# EAGLE design CAN-BUS(FD) HAT for Raspberry Pi (EAGLE 9.5.2)
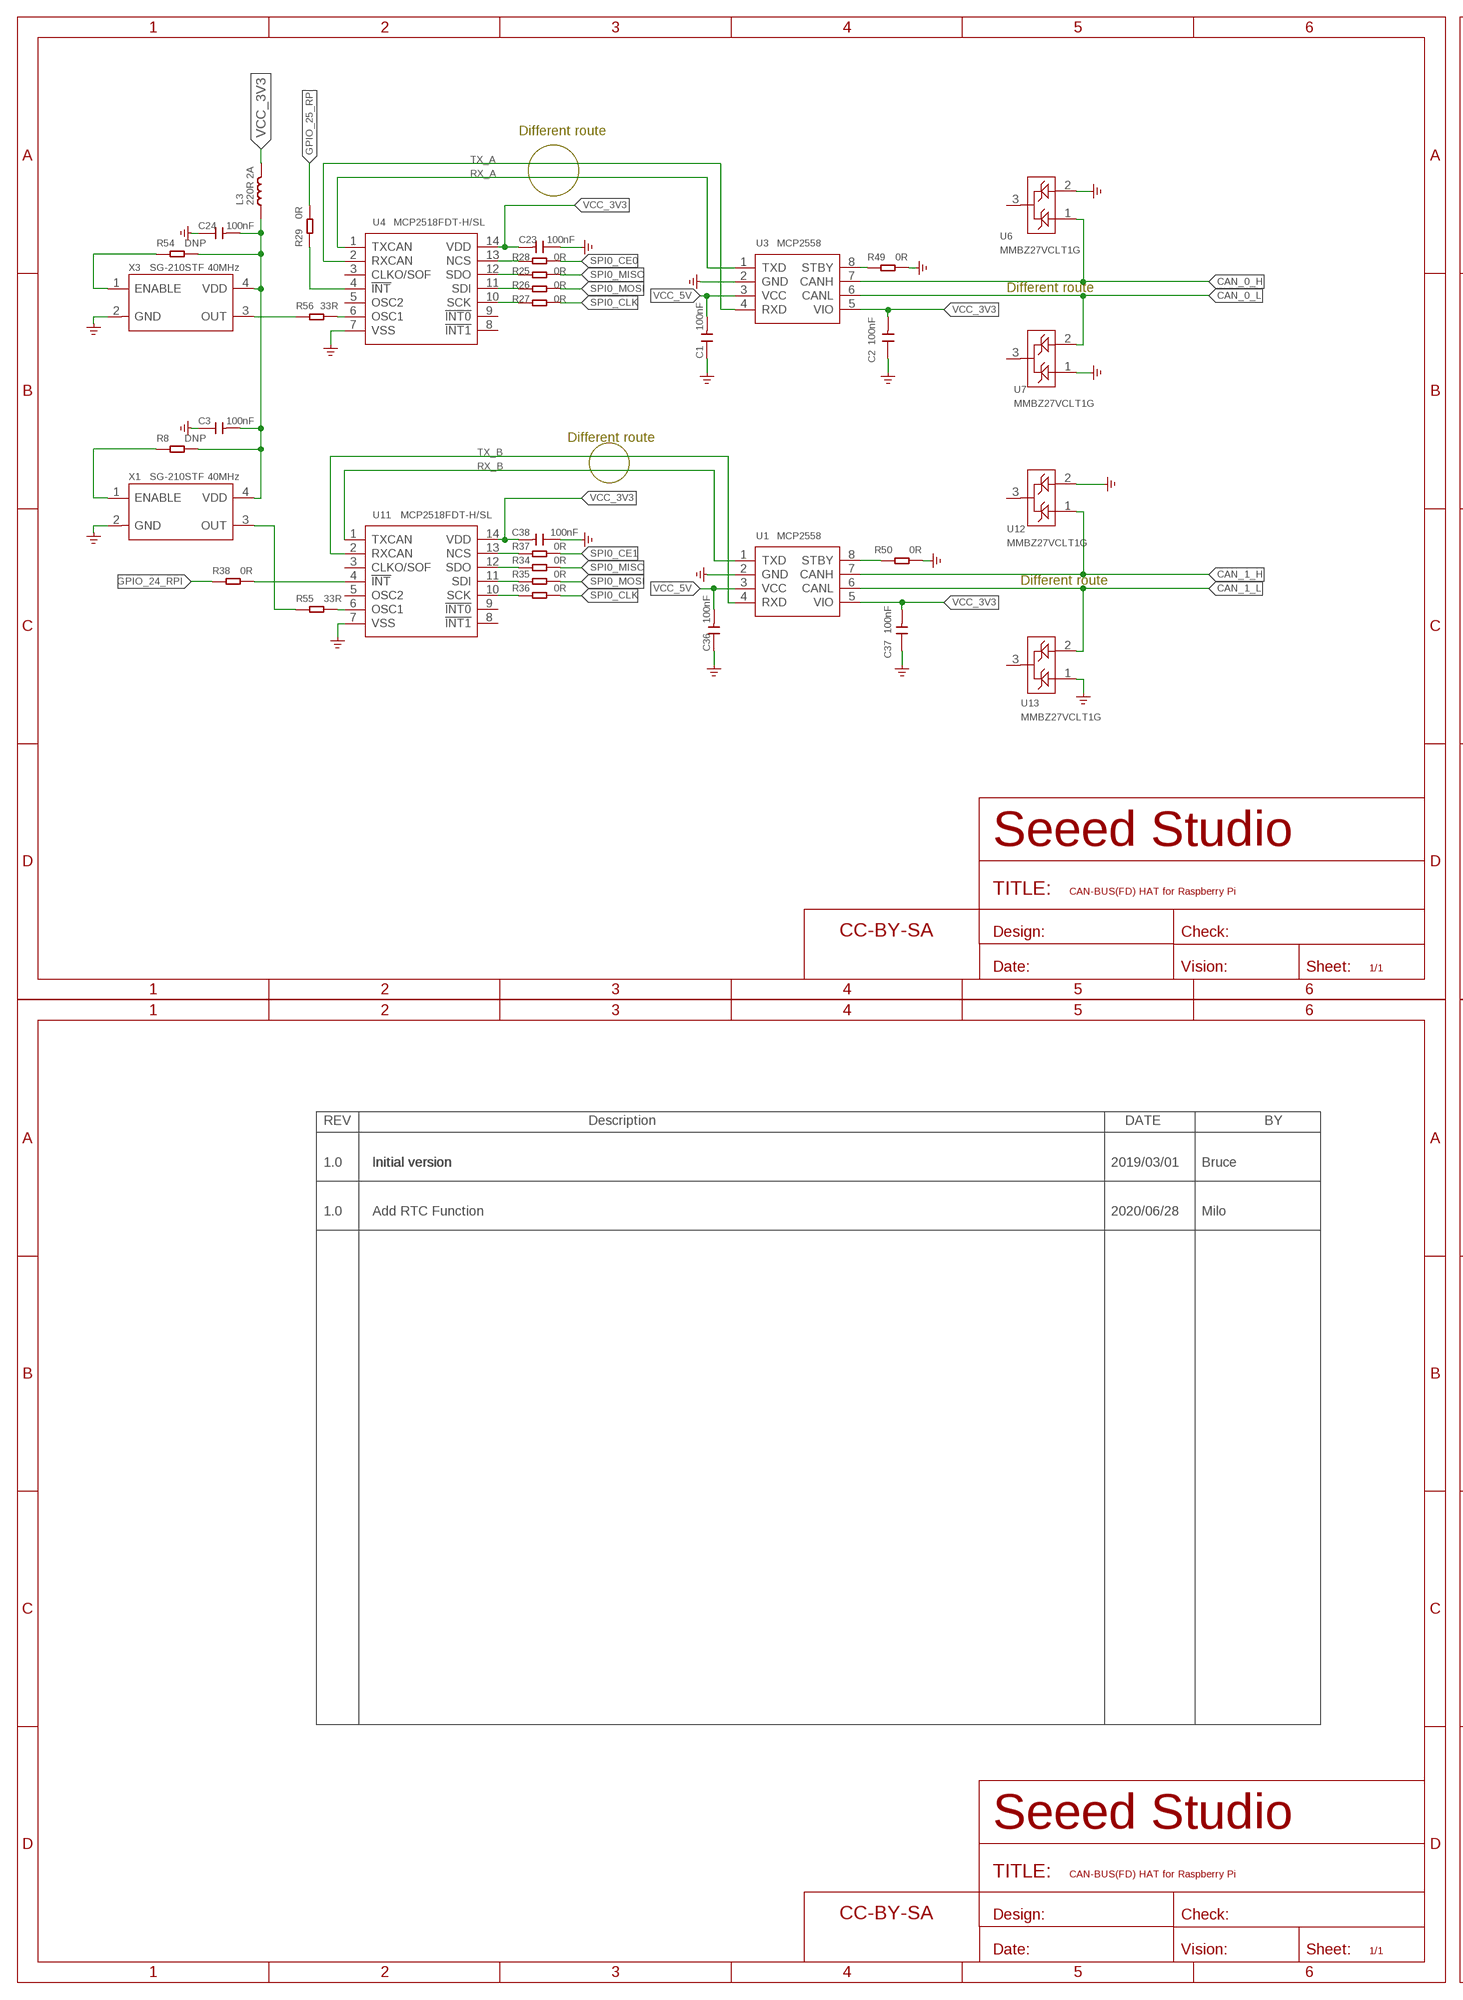
[diagram p0: schematic, sheet 1, part 1 of 2]
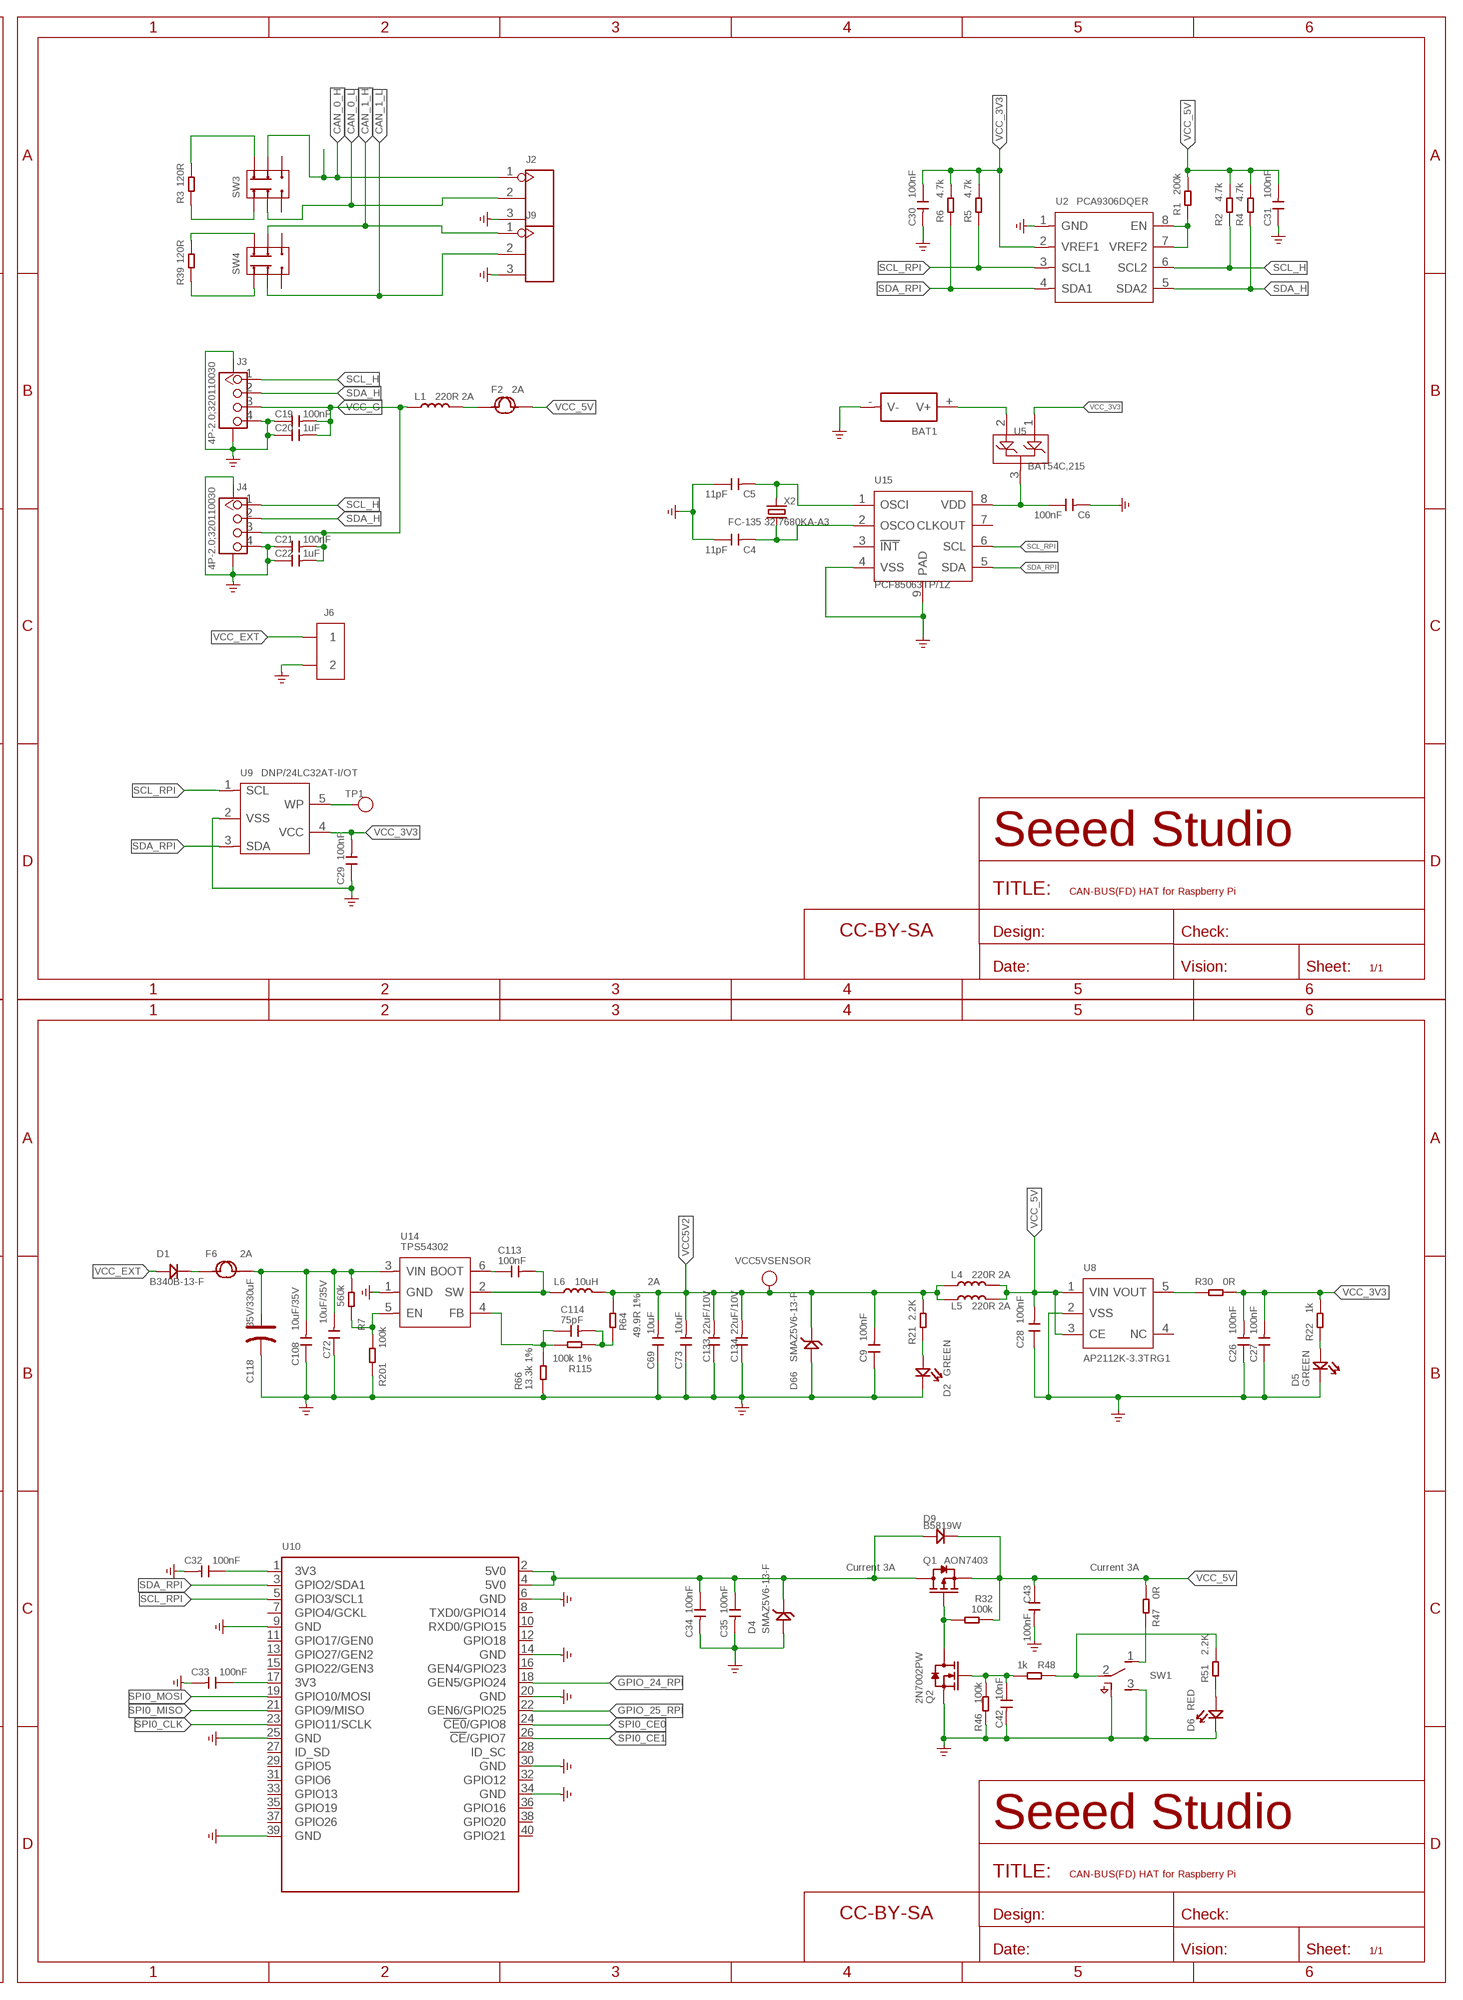
[diagram p1: schematic, sheet 1, part 2 of 2]

## Parts
BAT1  BAT-HOLDER'SMD-1220'  [BAT2P-SMD-16.4-CR1220]
C1  100nF  CAP-0603  [C0603]
C2  100nF  CAP-0603  [C0603]
C3  100nF  CAP-0603  [C0603]
C4  11pF  CAP-0603  [C0603]
C5  11pF  CAP-0603  [C0603]
C6  100nF  CAP-0603  [C0603]
C9  100nF  CAP-0603  [C0603]
C19  100nF  CAP-0603  [C0603]
C20  1uF  CAP-0603  [C0603]
C21  100nF  CAP-0603  [C0603]
C22  1uF  CAP-0603  [C0603]
C23  100nF  CAP-0603  [C0603]
C24  100nF  CAP-0603  [C0603]
C26  100nF  CAP-0603  [C0603]
C27  100nF  CAP-0603  [C0603]
C28  100nF  CAP-0603  [C0603]
C29  100nF  CAP-0603  [C0603]
C30  100nF  CAP-0603  [C0603]
C31  100nF  CAP-0603  [C0603]
C32  100nF  CAP-0603  [C0603]
C33  100nF  CAP-0603  [C0603]
C34  100nF  CAP-0603  [C0603]
C35  100nF  CAP-0603  [C0603]
C36  100nF  CAP-0603  [C0603]
C37  100nF  CAP-0603  [C0603]
C38  100nF  CAP-0603  [C0603]
C42  10nF  CAP-0603  [C0603]
C43  100nF  CAP-0603  [C0603]
C69  10uF  CAP-0805  [C0805]
C72  10uF/35V  CAP-0805  [C0805]
C73  10uF  CAP-0805  [C0805]
C108  10uF/35V  CAP-0805  [C0805]
C113  100nF  CAP-0603  [C0603]
C114  75pF  CAP-0603  [C0603]
C118  35V/330uF  CAP-POLAR-ELECTRO-E  [ELECTRO-SMD-E-7.8MM]
C133  22uF/10V  CAP-1206  [C1206]
C134  22uF/10V  CAP-1206  [C1206]
D1  B340B-13-F  DIODE'SMB'  [DO-214AA]
D2  GREEN  LED'0603'  [LED-0603]
D4  SMAZ5V6-13-F  D-ZENER-2P-SMA  [DO-214AC]
D5  GREEN  LED'0603'  [LED-0603]
D6  RED  LED'0603'  [LED-0603]
D9  B5819W  DIODE'1206'  [SOD-123]
D66  SMAZ5V6-13-F  D-ZENER-2P-SMA  [DO-214AC]
F2  2A  FUSE+'1210'  [FS1210]
F6  2A  FUSE'1812'  [F1812]
FR1  SEEEDSTUDIO-OPEN-SCH-FRAME  [SEEEDSTUDIO-PCB-FRAME]
FR2  SEEEDSTUDIO-OPEN-SCH-FRAME  [SEEEDSTUDIO-PCB-FRAME]
FR3  SEEEDSTUDIO-OPEN-SCH-FRAME  [SEEEDSTUDIO-PCB-FRAME]
FR5  SEEEDSTUDIO-OPEN-SCH-FRAME  [SEEEDSTUDIO-PCB-FRAME]
J2  SCREW-TERMINAL-3P'3.5'  [H3-3.5-11.5X7.0MM]
J3  4P-2.0;320110030  GROVE-CONNECTOR-SMD'DD'  [HW4-SMD-2.0]
J4  4P-2.0;320110030  GROVE-CONNECTOR-SMD'DD'  [HW4-SMD-2.0]
J6  SCREW-TERMINAL-2P'3.5'  [H2-3.5-7.0X7.0MM]
J9  SCREW-TERMINAL-3P'3.5'  [H3-3.5-11.5X7.0MM]
L1  220R 2A  INDUCTOR/FERRITE-BEAD'0805'  [L0805]
L3  220R 2A  INDUCTOR/FERRITE-BEAD'0805'  [L0805]
L4  220R 2A  INDUCTOR/FERRITE-BEAD'0805'  [L0805]
L5  220R 2A  INDUCTOR/FERRITE-BEAD'0805'  [L0805]
L6  10uH  INDUCTOR-8040  [L8040]
Q1  AON7403  MOSFET-P-AON7403  [DFN8P-0.65-3X3X0.8MM]
Q2  2N7002PW  MOSFET-N'SOT23'  [SOT-23]
R1  200k  RES-0603  [R0603]
R2  4.7k  RES-0603  [R0603]
R3  120R  RES-1206  [R1206]
R4  4.7k  RES-0603  [R0603]
R5  4.7k  RES-0603  [R0603]
R6  4.7k  RES-0603  [R0603]
R7  560k  RES-0603  [R0603]
R8  DNP  R-0603  [0603]
R21  2.2K  R-0603  [0603]
R22  1k  R-0603  [0603]
R25  0R  R-0603  [0603]
R26  0R  R-0603  [0603]
R27  0R  R-0603  [0603]
R28  0R  R-0603  [0603]
R29  0R  R-0603  [0603]
R30  0R  RES-0603  [R0603]
R32  100k  R-0603  [0603]
R34  0R  R-0603  [0603]
R35  0R  R-0603  [0603]
R36  0R  R-0603  [0603]
R37  0R  R-0603  [0603]
R38  0R  R-0603  [0603]
R39  120R  RES-1206  [R1206]
R46  100k  R-0603  [0603]
R47  0R  R-0603  [0603]
R48  1k  R-0603  [0603]
R49  0R  R-0603  [0603]
R50  0R  R-0603  [0603]
R51  2.2K  R-0603  [0603]
R54  DNP  R-0603  [0603]
R55  33R  R-0603  [0603]
R56  33R  R-0603  [0603]
R64  49.9R 1%  RES-0603  [R0603]
R66  13.3k 1%  RES-0603  [R0603]
R115  100k 1%  RES-0603  [R0603]
R201  100k  RES-0603  [R0603]
SW1  SWITCH-3+4P-311030001  [SW7-SMD-L6.7X2.7X3.2MM]
SW3  SWITCH-2CH-6P-311010004  [SW6-2.54-9.0X3.5X3.2+2.0MM]
SW4  SWITCH-2CH-6P-311010004  [SW6-2.54-9.0X3.5X3.2+2.0MM]
TP1  DNP  TEST-POINT'4545'  [TP-D45MIL]
U1  MCP2558  TRANSCEIVER-ATA6561'GAQW'  [SOIC8-1.27-5X4MM]
U2  PCA9306DQER  TRANSLATOR-PCA9306DQER  [X2SON8-0.35-1.4X1X0.37MM]
U3  MCP2558  TRANSCEIVER-ATA6561'GAQW'  [SOIC8-1.27-5X4MM]
U4  MCP2518FDT-H/SL  INTERFACE-MCP2517FD'H/SL'  [SOIC14-1.27-8.65X3.9MM]
U5  BAT54C,215  DIODE-BAT54C  [SOT-23]
U6  MMBZ27VCLT1G  DIODE-BAT54C  [SOT-23]
U7  MMBZ27VCLT1G  DIODE-BAT54C  [SOT-23]
U8  AP2112K-3.3TRG1  PMIC-XC6220-SOT-25  [SOT-25]
U9  DNP/24LC32AT-I/OT  MEMORY-24LC32A'310090051'  [SOT-23-5]
U10  RPI-ZERO-SMD/NP  [H2X20-SMD/NP-2.54]
U11  MCP2518FDT-H/SL  INTERFACE-MCP2517FD'H/SL'  [SOIC14-1.27-8.65X3.9MM]
U12  MMBZ27VCLT1G  DIODE-BAT54C  [SOT-23]
U13  MMBZ27VCLT1G  DIODE-BAT54C  [SOT-23]
U14  TPS54302  PMIC-TPS54302  [SOT-23-6]
U15  PCF85063TP/1Z  RTC-PCF85063TP  [HWSON8-0.5-2X3X0.75MM]
VCC5VSENSOR  DNP  TEST-POINT'4545'  [TP-D45MIL]
X1  SG-210STF 40MHz  CRYSTAL-OSCILLATOR-2520  [X4-SMD-2.5X2.0X1.0MM]
X2  FC-135 32.7680KA-A3  CRYSTAL-2P-3215  [X2-SMD-3.2X1.5X0.55MM]
X3  SG-210STF 40MHz  CRYSTAL-OSCILLATOR-2520  [X4-SMD-2.5X2.0X1.0MM]

## Nets
3V3@1: C32.1 U10.1(3V3)
3V3@2: C33.1 U10.17(3V3)
CAN_0_H: J2.1 SW3.COM2 U3.7(CANH) U6.1
CAN_0_L: J2.2 SW3.COM1 U3.6(CANL) U7.2
CAN_1_H: J9.1 SW4.COM2 U1.7(CANH) U12.1
CAN_1_L: J9.2 SW4.COM1 U1.6(CANL) U13.2
GND: BAT1.-(V-) C1.1 C2.1 C3.1 C4.1 C5.1 C6.2 C9.1 C19.1 C20.1 C21.1 C22.1 C23.1 C24.1 C26.1 C27.1 C28.1 C29.1 C30.2 C31.1 C32.2 C33.2 C34.2 C35.2 C36.1 C37.1 C38.1 C42.2 C43.2 C69.1 C72.1 C73.1 C108.1 C118.- C133.1 C134.1 D2.- D4.1(+) D5.- D6.- D66.1(+) J2.3 J3.4 J3.SS1 J3.SS2 J4.4 J4.SS1 J4.SS2 J6.2 J9.3 Q2.2(S) R46.1 R49.2 R50.2 R66.1 R201.1 SW1.3(B) SW1.SS1(SS2) SW1.SS2 SW1.SS3(SS2) SW1.SS4(SS2) U1.2(GND) U2.1(GND) U3.2(GND) U4.7(VSS) U6.2 U7.1 U8.2(VSS) U9.2(VSS) U10.6(GND) U10.9(GND) U10.14(GND) U10.20(GND) U10.25(GND) U10.30(GND) U10.34(GND) U10.39(GND) U11.7(VSS) U12.2 U13.1 U14.1(GND) U15.4(VSS) U15.9(PAD) X1.2(GND) X3.2(GND) ; supply symbol labelled GND_POWER
GPIO_24_RPI: R38.2 U10.18(GEN5/GPIO24)
GPIO_25_RPI: R29.2 U10.22(GEN6/GPIO25)
N$1: R47.1 SW1.1(A)
N$2: D1.2(-) F6.1
N$3: R55.1 U11.6(OSC1)
N$4: C114.2 R64.1 R115.1
N$5: R55.2 X1.3(OUT)
N$6: R49.1 U3.8(STBY)
N$7: R7.1 R201.2 U14.5(EN)
N$8: R8.2 X1.1(ENABLE)
N$9: C3.2 C24.2 L3.1 R8.1 R54.1 X1.4(VDD) X3.4(VDD)
N$10: R39.1 SW4.CH2A
N$11: R56.2 X3.3(OUT)
N$12: R39.2 SW4.CH1A
N$13: R29.1 U4.4(!INT)
N$14: R38.1 U11.4(!INT)
N$15: R50.1 U1.8(STBY)
N$16: R37.1 U11.13(NCS)
N$17: R3.1 SW3.CH2A
N$18: R28.1 U4.13(NCS)
N$19: R25.1 U4.12(SDO)
N$20: R26.1 U4.11(SDI)
N$21: R27.1 U4.10(SCK)
N$22: R3.2 SW3.CH1A
N$23: D5.+ R22.1
N$24: C6.1 U5.3 U15.8(VDD)
N$25: R1.1 U2.7(VREF2) U2.8(EN)
N$26: R34.1 U11.12(SDO)
N$27: BAT1.+(V+) U5.2
N$28: C4.2 U15.2(OSCO) X2.1
N$29: C5.2 U15.1(OSCI) X2.2
N$30: R35.1 U11.11(SDI)
N$31: R36.1 U11.10(SCK)
N$32: TP1.T U9.5(WP)
N$33: R56.1 U4.6(OSC1)
N$38: D2.+ R21.1
N$40: D6.+ R51.1
N$42: C113.2 L6.1 U14.2(SW)
N$46: R30.1 U8.5(VOUT)
N$49: Q1.4(G) Q2.3(D) R32.2
N$51: R48.1 R51.2 SW1.2(COM)
N$52: C42.1 Q2.1(G) R46.2 R48.2
N$53: F2.1 L1.2
N$54: R54.2 X3.1(ENABLE)
N$86: C113.1 U14.6(BOOT)
N$120: C114.1 R66.2 R115.2 U14.4(FB)
N$199: C72.2 C108.2 C118.+ F6.2 R7.2 U14.3(VIN)
RX_A: U3.1(TXD) U4.1(TXCAN)
RX_B: U1.1(TXD) U11.1(TXCAN)
SCL_H: J3.1 J4.1 R2.1 U2.6(SCL2)
SCL_RPI: R5.1 U2.3(SCL1) U9.1(SCL) U10.5(GPIO3/SCL1) U15.6(SCL)
SDA_H: J3.2 J4.2 R4.1 U2.5(SDA2)
SDA_RPI: R6.1 U2.4(SDA1) U9.3(SDA) U10.3(GPIO2/SDA1) U15.5(SDA)
SPI0_CE0: R28.2 U10.24(!CE0!/GPIO8)
SPI0_CE1: R37.2 U10.26(!CE!/GPIO7)
SPI0_CLK: R27.2 R36.2 U10.23(GPIO11/SCLK)
SPI0_MISO: R25.2 R34.2 U10.21(GPIO9/MISO)
SPI0_MOSI: R26.2 R35.2 U10.19(GPIO10/MOSI)
TX_A: U3.4(RXD) U4.2(RXCAN)
TX_B: U1.4(RXD) U11.2(RXCAN)
VCC5V2: C9.2 C69.2 C73.2 C133.2 C134.2 D66.2(-) L4.1 L5.1 L6.2 R21.2 R64.2 VCC5VSENSOR.T
VCC_3V3: C2.2 C23.2 C26.2 C27.2 C29.2 C30.1 C37.2 C38.2 L3.2 R5.2 R6.2 R22.2 R30.2 U1.5(VIO) U2.2(VREF1) U3.5(VIO) U4.14(VDD) U5.1 U9.4(VCC) U11.14(VDD)
VCC_5V: C1.2 C28.2 C31.2 C36.2 C43.1 D9.- F2.2 L4.2 L5.2 Q1.1(S) Q1.2(S) Q1.3(S) R1.2 R2.2 R4.2 R32.1 R47.2 U1.3(VCC) U3.3(VCC) U8.1(VIN) U8.3(CE)
VCC_5V_PI: C34.1 C35.1 D4.2(-) D9.+ Q1.5(D) Q1.6(D) Q1.7(D) Q1.8(D) U10.2(5V0) U10.4(5V0)
VCC_EXT: D1.1(+) J6.1
VCC_G: C19.2 C20.2 C21.2 C22.2 J3.3 J4.3 L1.1
Unconnected: SW3.CH1B SW3.CH2B SW4.CH1B SW4.CH2B U4.3(CLKO/SOF) U4.5(OSC2) U4.8(!INT1) U4.9(!INT0) U6.3 U7.3 U8.4(NC) U10.7(GPIO4/GCKL) U10.8(TXD0/GPIO14) U10.10(RXD0/GPIO15) U10.11(GPIO17/GEN0) U10.12(GPIO18) U10.13(GPIO27/GEN2) U10.15(GPIO22/GEN3) U10.16(GEN4/GPIO23) U10.27(ID_SD) U10.28(ID_SC) U10.29(GPIO5) U10.31(GPIO6) U10.32(GPIO12) U10.33(GPIO13) U10.35(GPIO19) U10.36(GPIO16) U10.37(GPIO26) U10.38(GPIO20) U10.40(GPIO21) U11.3(CLKO/SOF) U11.5(OSC2) U11.8(!INT1) U11.9(!INT0) U12.3 U13.3 U15.3(!INT) U15.7(CLKOUT)

## Notes on the sheet
- Different route
- Different route
- Different route
- Different route
- 1.0 | Initial version | initial version | 2019/03/01 | Bruce
- 1.0 | Add RTC Function | 2020/06/28 | Milo
- 2A
- Current 3A | Current 3A

## Library data of the parts
BAT1 = Connector-new:BAT-HOLDER: BAT2P-13.5-CR1220:320170002;BAT2P-SMD-20.5-CR1632:320170007;METAL-CR2032-D20.0*H6.3MM:320170003;METAL-CR2032-SMD:320170006;PLASTIC-CR1220-L15.06*W13.0*H4.1MM:320170000;PLASTIC-CR2032-L25.2*W15.6*H5.2MM:320170005;BAT2P-11.55-D12.55-CR1220:313010022
C1-C6 C9 C19-C24 C26-C38 C42 C43 C69 C72 C73 C108 C113 C114 C133 C134 = Discrete-new:CAP: Ceramic Capacitors
C118 = Discrete-new:CAP-POLAR: Electrolytic Capacitors,Tantalum Capacitors and Super Capacitors
D1 = Discrete-new:DIODE
D2 D5 D6 = Discrete-new:LED
D4 D66 = Discrete-new:D-ZENER-2P
D9 = Discrete-new:DIODE*
F2 = Discrete-new:FUSE+
F6 = Discrete-new:FUSE
FR1-FR3 FR5 = moudle-new:SEEEDSTUDIO-OPEN-SCH-FRAME
J2 J9 = Connector-new:SCREW-TERMINAL-3P: 3P-3.5:320110007;3P-5.0:320110029
J3 J4 = Connector-new:GROVE-CONNECTOR-SMD: 4P-SMD-2.0:320110030;4P-SMD-2.0-90D:320110032
J6 = Connector-new:SCREW-TERMINAL-2P: 2P-3.5:320110028;2P-5.0:320110031
L1 L3-L5 = Discrete-new:INDUCTOR/FERRITE-BEAD
L6 = Discrete-new:INDUCTOR
Q1 = Discrete-new:MOSFET-P
Q2 = Discrete-new:MOSFET-N: IRLL014: http://www.vishay.com/docs/91319/sihll014.pdf
R1-R7 R30 R39 R64 R66 R115 R201 = Discrete-new:RES
R8 R21 R22 R25-R29 R32 R34-R38 R46-R51 R54-R56 = discrete:R*
SW1 = Discrete-new:SWITCH-3+4P
SW3 SW4 = Switch:SWITCH-2CH-6P
TP1 VCC5VSENSOR = Discrete-new:TEST-POINT; PARTNO: DNP
U1 U3 = IC-new:TRANSCEIVER-ATA6561
U2 = IC-new:TRANSLATOR-PCA9306DQER
U4 U11 = IC-new:INTERFACE-MCP2517FD
U5-U7 U12 U13 = Discrete-new:DIODE-BAT54C: Schottky barrier diodes
U8 = IC-new:PMIC-XC6220
U9 = IC-new:MEMORY-24LC32A: 310090051
U10 = IC-new:RPI-ZERO
U14 = IC-new:PMIC-TPS54302
U15 = IC-new:RTC-PCF85063TP
X1 X3 = Discrete-new:CRYSTAL-OSCILLATOR
X2 = Discrete-new:CRYSTAL-2P

## Board
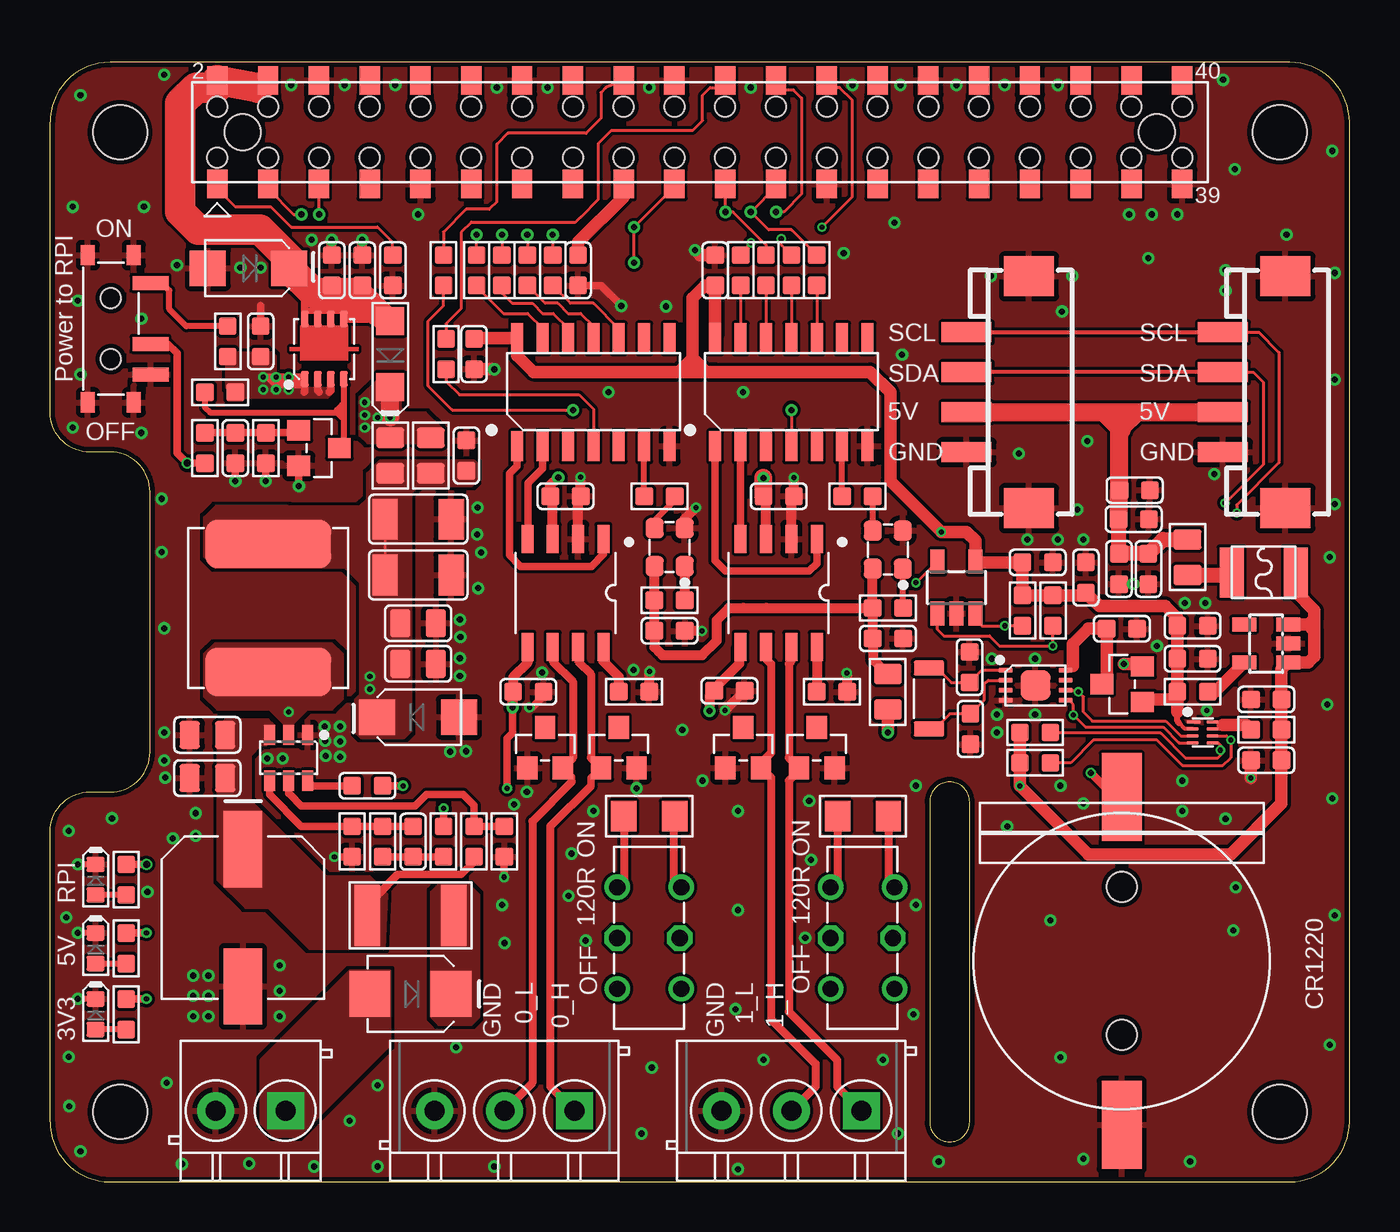
[diagram p2: board, top side]
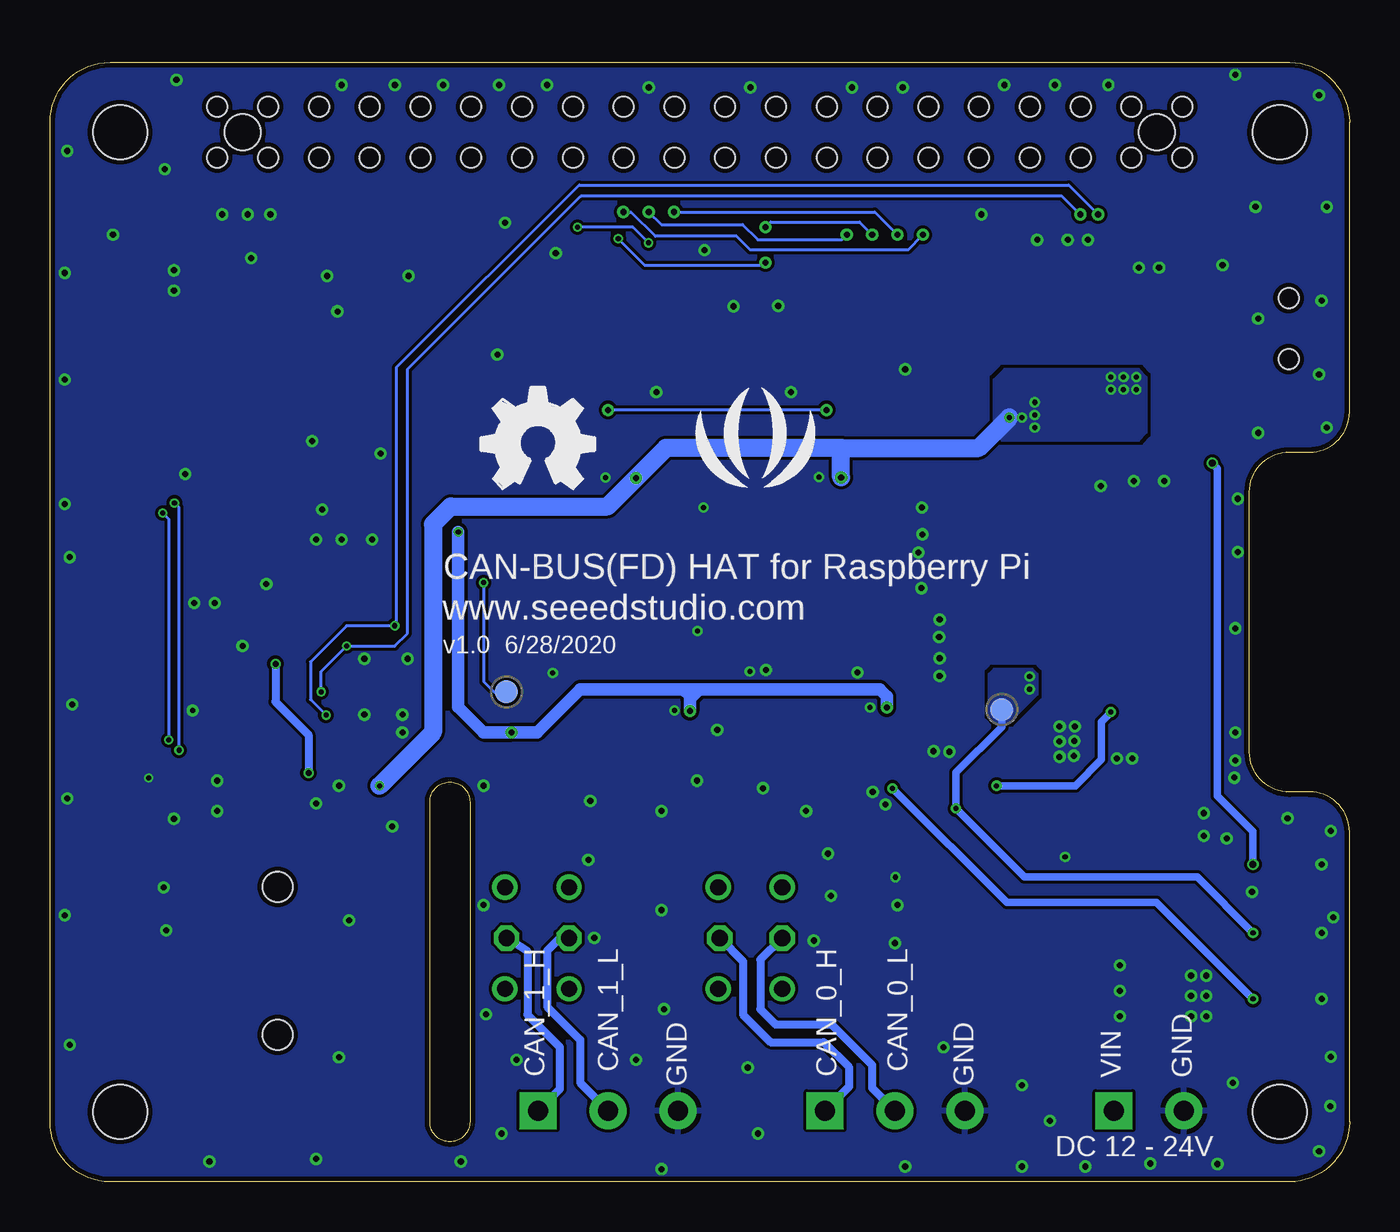
[diagram p3: board, bottom side, seen from below]

Size 65 x 56 mm. Coordinates in mm from the lower left corner, seen from the top.
Outline: 3,19.5 2,19.5 arc90 0,17.5 0,3 arc90 3,0 62,0 arc90 65,3 65,53 arc90 62,56 3,56 arc90 0,53 0,38.5 arc90 2,36.5 3,36.5
Outline: 3,19.5 arc90 5,21.5 5,34.5 arc90 3,36.5
Outline: 44,3 arc90 45,2 arc90 46,3 46,19 arc90 45,20 arc90 44,19 44,3
Copper layers (1*16): Top 0.035mm / dielectric 1.5mm / Bottom 0.035mm
Design rules "SeeedStudio_2layer_DRU_no_angle_20140221": minimum track width 1mil, minimum drill 10mil, track to track 6mil, track to pad 6mil, pad to pad 6mil, via to via 6mil, smd to smd 0mil, copper to edge 10mil, drill to drill 10mil, minimum pad ring 4mil, minimum via ring 4mil, stop-mask expansion 2mil, vias tented up to drill 25mil, thermal gap 10mil
Holes 2.7 mm at 3.5,3.5 3.5,52.5 61.5,52.5 61.5,3.5

### Footprints (pad centres in the part's own frame; a part is rotated, then mirrored left to right if it is on the bottom)
BAT2P-SMD-16.4-CR1220 = smd 2 x 4.4: + 0,-8.2; - 0,8.2 | hole 1.5: 0,3.7; 0,-3.7
C0603 = smd 0.889 x 0.889: 1 -0.762,0; 2 0.762,0
C0805 = smd 1.016 x 1.397: 1 -0.889,0; 2 0.889,0
ELECTRO-SMD-E-7.8MM = smd 3.81 x 1.905: + 3.429,0; - -3.429,0
C1206 = smd 1.27 x 2.032: 1 -1.651,0; 2 1.651,0
DO-214AA = smd 2.032 x 2.286: 1 2.032,0; 2 -2.032,0
LED-0603 = smd 0.762 x 0.889: + 0.762,0; - -0.762,0
DO-214AC = smd 1.8 x 1.77: 1 2.042,0; 2 -2.042,0
SOD-123 = smd 1.397 x 1.397: + 1.651,0; - -1.651,0
FS1210 = smd 1.2 x 2.5: 1 -1.6,0; 2 1.6,0
F1812 = smd 1.27 x 3.048: 1 -2.159,0; 2 2.159,0
H3-3.5-11.5X7.0MM = drill 1 pad 1.85 square: 1 0,-3.5 | drill 1 pad 1.85: 2 0,0; 3 0,3.5
HW4-SMD-2.0 = smd 1 x 2.5: 1 -3,0; 2 -1,0; 3 1,0; 4 3,0 | smd 2 x 2.5: SS1 -5.8,3.123; SS2 5.8,3.123
H2-3.5-7.0X7.0MM = drill 1 pad 1.85 square: 1 -1.75,0 | drill 1 pad 1.85: 2 1.75,0
L0805 = smd 1.016 x 1.397: 1 -0.889,0; 2 0.889,0
L8040 = smd 2.4 x 6.3: 1 -3.2,0; 2 3.2,0
DFN8P-0.65-3X3X0.8MM = smd 0.8 x 0.4: 1 -1.5,0.975; 2 -1.5,0.325; 3 -1.5,-0.325; 4 -1.5,-0.975; 5 1.5,-0.975; 6 1.5,-0.325; 7 1.5,0.325; 8 1.5,0.975
SOT-23 = smd 1.143 x 1.016: 1 1.016,-0.889; 2 1.016,0.889; 3 -1.016,0
R0603 = smd 0.889 x 0.889: 1 -0.762,0; 2 0.762,0
R1206 = smd 1.27 x 1.524: 1 -1.27,0; 2 1.27,0
0603 = smd 0.889 x 0.889: 1 -0.762,0; 2 0.762,0
SW7-SMD-L6.7X2.7X3.2MM = smd 1.8 x 0.7: 1 1.978,2.286; 2 1.978,-0.762; 3 1.978,-2.286 | smd 0.7 x 1.016: SS1 -1.15,-3.683; SS2 1.15,-3.683; SS3 1.15,3.683; SS4 -1.15,3.683 | hole 1: 0,-1.524; 0,1.524
SW6-2.54-9.0X3.5X3.2+2.0MM = drill 0.813 pad 1.27: CH1A -2.54,-1.6; CH1B 2.54,-1.6; CH2A -2.54,1.6; CH2B 2.54,1.6 | drill 0.813 pad 1.27 octagon: COM1 0,-1.6; COM2 0,1.524
TP-D45MIL = smd 1.143 x 1.143: T 0,0
SOIC8-1.27-5X4MM = smd 0.6 x 1.4: 1 -1.905,-2.7; 2 -0.635,-2.7; 3 0.635,-2.7; 4 1.905,-2.7; 5 1.905,2.7; 6 0.635,2.7; 7 -0.635,2.7; 8 -1.905,2.7
X2SON8-0.35-1.4X1X0.37MM = smd 0.16 x 0.7: 1 -0.525,-0.45 | smd 0.16 x 0.6: 2 -0.175,-0.5; 3 0.175,-0.5; 4 0.525,-0.5; 5 0.525,0.5; 6 0.175,0.5; 7 -0.175,0.5; 8 -0.525,0.5
SOIC14-1.27-8.65X3.9MM = smd 0.6 x 1.5: 1 -3.81,-2.7; 2 -2.54,-2.7; 3 -1.27,-2.7; 4 0,-2.7; 5 1.27,-2.7; 6 2.54,-2.7; 7 3.81,-2.7; 8 3.81,2.7; 9 2.54,2.7; 10 1.27,2.7; 11 0,2.7; 12 -1.27,2.7; 13 -2.54,2.7; 14 -3.81,2.7
SOT-25 = smd 0.69 x 1.2: 1 -0.95,-1.1; 2 0,-1.1; 3 0.95,-1.1; 4 0.95,1.1; 5 -0.95,1.1
SOT-23-5 = smd 0.69 x 1.2: 1 -0.95,-1.3; 2 0,-1.3; 3 0.95,-1.3; 4 0.95,1.3; 5 -0.95,1.3
H2X20-SMD/NP-2.54 = smd 1.02 x 1.42: 1 -24.13,-2.59; 2 -24.13,2.59; 3 -21.59,-2.59; 4 -21.59,2.59; 5 -19.05,-2.59; 6 -19.05,2.59; 7 -16.51,-2.59; 8 -16.51,2.59; 9 -13.97,-2.59; 10 -13.97,2.59; 11 -11.43,-2.59; 12 -11.43,2.59; 13 -8.89,-2.59; 14 -8.89,2.59; 15 -6.35,-2.59; 16 -6.35,2.59; 17 -3.81,-2.59; 18 -3.81,2.59; 19 -1.27,-2.59; 20 -1.27,2.59; 21 1.27,-2.59; 22 1.27,2.59; 23 3.81,-2.59; 24 3.81,2.59; 25 6.35,-2.59; 26 6.35,2.59; 27 8.89,-2.59; 28 8.89,2.59; 29 11.43,-2.59; 30 11.43,2.59; 31 13.97,-2.59; 32 13.97,2.59; 33 16.51,-2.59; 34 16.51,2.59; 35 19.05,-2.59; 36 19.05,2.59; 37 21.59,-2.59; 38 21.59,2.59; 39 24.13,-2.59; 40 24.13,2.59 | hole 1.8: -22.86,0; 22.86,0 | hole 1: -24.13,1.27; -24.13,-1.27; -21.59,1.27; -21.59,-1.27; -19.05,-1.27; -19.05,1.27; -16.51,-1.27; -16.51,1.27; -13.97,1.27; -13.97,-1.27; -11.43,-1.27; -11.43,1.27; -6.35,1.27; -8.89,1.27; -8.89,-1.27; -6.35,-1.27; -3.81,1.27; -3.81,-1.27; -1.27,1.27; 1.27,1.27; 3.81,1.27; 6.35,1.27; 8.89,1.27; 11.43,1.27; 13.97,1.27; 16.51,1.27; 19.05,1.27; 21.59,1.27; 21.59,-1.27; 24.13,1.27; 19.05,-1.27; 16.51,-1.27; 13.97,-1.27; 11.43,-1.27; 8.89,-1.27; 6.35,-1.27; 3.81,-1.27; 1.27,-1.27; -1.27,-1.27; 24.13,-1.27
SOT-23-6 = smd 0.55 x 1.016: 1 -0.95,-1.143; 2 0,-1.143; 3 0.95,-1.143; 4 0.95,1.143; 5 0,1.143; 6 -0.95,1.143
HWSON8-0.5-2X3X0.75MM = smd 0.25 x 0.7: 1 -0.75,-1.5; 2 -0.25,-1.5; 3 0.25,-1.5; 4 0.75,-1.5; 5 0.75,1.5; 6 0.25,1.5; 7 -0.25,1.5; 8 -0.75,1.5 | smd 1.5 x 1.5: 9 0,0
X4-SMD-2.5X2.0X1.0MM = smd 1 x 0.9: 1 -0.95,-0.75; 2 0.95,-0.75; 3 0.95,0.75; 4 -0.95,0.75
X2-SMD-3.2X1.5X0.55MM = smd 0.762 x 1.524: 1 -1.524,0; 2 1.524,0

### Placement (x,y rotation side)
BAT1  53.61,11.05 180 top
C1  36.45,34.29 180 top
C2  23.93,24.51 180 top
C3  41.91,27.18 180 top
C4  46.04,22.65 90 top
C5  45.99,25.74 270 top
C6  53.61,27.66 0 top
C9  20.83,36.32 270 top
C19  54.2,33.15 180 top
C20  54.94,30.66 90 top
C21  54.25,34.59 180 top
C22  53.47,30.66 90 top
C23  21.21,41.4 90 top
C24  30.99,27.56 180 top
C26  57.15,26.16 180 top
C27  57.15,27.81 180 top
C28  60.83,24.13 0 top
C29  49.4,30.99 180 top
C30  51.82,30.23 90 top
C31  60.83,21.08 0 top
C32  17.14,45.59 270 top
C33  26.42,45.59 270 top
C34  14.1,45.59 90 top
C35  15.62,45.59 90 top
C36  25.78,34.29 180 top
C37  33.99,24.56 180 top
C38  33.27,45.59 270 top
C42  9.27,36.7 270 top
C43  10.54,42.04 90 top
C69  18.41,27.94 180 top
C72  7.87,22.35 0 top
C73  18.41,25.91 180 top
C108  7.87,20.19 0 top
C113  15.88,19.81 0 top
C114  18.16,17.02 270 top
C118  9.65,13.21 90 top
C133  18.41,33.15 180 top
C134  18.41,30.35 180 top
D1  18.03,9.4 180 top
D2  2.29,11.68 270 top
D4  9.93,45.69 180 top
D5  2.29,8.38 270 top
D6  2.29,15.11 270 top
D9  17.02,41.4 90 top
D66  18.41,23.24 0 top
F2  60.71,30.48 0 top
F6  18.03,13.34 180 top
FR1  9.91,-30.86 0 top  (outside the outline)
FR2  9.91,-23.75 0 top  (outside the outline)
FR3  9.91,-38.23 0 top  (outside the outline)
FR5  9.91,-16.64 0 top  (outside the outline)
J2  22.73,3.56 90 top
J3  45.85,39.5 270 top
J4  58.67,39.5 270 top
J6  10.03,3.56 180 top
J9  37.08,3.56 90 top
L1  56.9,31.24 270 top
L3  41.91,24.51 270 top
L4  19.05,36.32 90 top
L5  17.02,36.32 90 top
L6  10.92,28.7 90 top
Q1  13.72,41.66 90 top
Q2  13.46,36.7 180 top
R1  60.83,22.61 0 top
R2  49.28,20.95 180 top
R3  29.97,18.29 180 top
R4  49.28,22.48 180 top
R5  50.16,28.57 90 top
R6  48.64,28.57 90 top
R7  21.21,17.02 270 top
R8  41.91,28.7 0 top
R21  3.81,11.68 90 top
R22  3.81,8.38 90 top
R25  22.61,45.59 90 top
R26  23.88,45.59 90 top
R27  25.15,45.59 90 top
R28  21.34,45.59 90 top
R29  19.81,41.4 90 top
R30  57.15,24.51 180 top
R32  8.51,39.5 180 top
R34  35.81,45.59 90 top
R35  37.08,45.59 90 top
R36  38.35,45.59 90 top
R37  34.54,45.59 90 top
R38  19.68,45.59 90 top
R39  40.67,18.29 180 top
R46  10.79,36.7 90 top
R47  8.89,42.04 270 top
R48  7.75,36.7 90 top
R49  29.21,24.51 0 top
R50  39.12,24.51 0 top
R51  3.81,15.11 90 top
R54  30.99,29.08 0 top
R55  40.39,34.29 0 top
R56  30.48,34.29 0 top
R64  19.68,17.02 90 top
R66  15.11,17.02 90 top
R115  16.64,17.02 90 top
R201  22.73,17.02 90 top
SW1  3.05,42.67 0 top
SW3  29.97,12.19 270 top
SW4  40.64,12.19 270 top
TP1  42.16,24.51 0 bottom
U1  36.45,29.46 180 top
U2  57.66,22.48 270 top
U3  25.78,29.46 180 top
U4  27.18,39.5 0 top
U5  53.63,24.89 0 top
U6  28.45,21.72 270 top
U7  24.77,21.72 270 top
U8  60.83,26.92 90 top
U9  45.34,29.72 0 top
U10  32.5,52.5 0 top
U11  37.08,39.5 0 top
U12  38.35,21.72 270 top
U13  34.67,21.72 270 top
U14  11.94,21.21 180 top
U15  49.3,24.83 270 top
U$42  [OSHW_FILLX200_NOTEXT_TNAME]  43.43,34.67 0 bottom
U$43  [SEEED-SILK-TNAME-280*268MIL]  29.72,36.45 0 bottom
VCC5VSENSOR  17.4,23.62 0 bottom
X1  41.91,31.62 90 top
X2  43.96,24.17 90 top
X3  30.99,31.75 90 top

### Tracks (layer width: path | path; a pad name or v marks a point on that pad's centre or on a via)
3V3@1
  Top 0.152: 8.38,50.16 8.38,49.62 8.42,49.62 9.27,48.77 11.05,48.77 12.06,47.75 16.38,47.75 17.14,46.99 C32.1
  Top 0.508: 8.26,50.04 8.38,50.16 8.38,50.29 U10.1
3V3@2
  Top 0.635: C33.1 26.42,46.99 28.69,49.26 U10.17
CAN_0_H
  Top 0.381: U6.1 27.05,20.19 27.05,19.81
  Top 0.406: 27.05,19.81 25.02,17.78 25.02,4.77 J2.1 | U3.7 26.42,26.04 27.05,25.4 27.05,21.21 U6.1
  Bottom 0.406: J2.1 25.02,4.77 25.02,5.71 26.29,6.99 28.96,6.99 30.33,8.36 30.33,11.02 SW3.COM2
CAN_0_L
  Top 0.381: 25.65,20.32 U7.2 26.1,20.26 26.1,20
  Top 0.406: J2.2 24.13,4.95 24.13,18.03 26.1,20 | U3.6 25.15,26.04 26.16,25.02 26.16,21.21 U7.2
  Bottom 0.406: SW3.COM1 28.39,12.19 29.46,11.11 29.46,8.64 28.7,7.87 25.91,7.87 23.88,5.84 23.88,4.7 J2.2
CAN_1_H
  Top 0.381: U12.1 37.47,20.98
  Top 0.406: U1.7 37.08,26.04 36.96,25.91 36.96,21.21 U12.1 37.47,20.57 36.96,20.07 36.96,8.51 39.37,6.1 39.37,4.77 J9.1
  Bottom 0.406: J9.1 39.5,4.64 39.5,6.73 41.12,8.36 41.12,11.53 SW4.COM2
CAN_1_L
  Top 0.381: U13.2 35.51,20.65 35.51,20.78 35.51,20.9
  Top 0.406: 35.51,20.78 36.07,20.22 36.07,10.85 36.07,8.13 38.29,5.91 38.29,4.76 J9.2 | U1.6 35.81,26.16 36.07,25.91 36.07,21.46 35.51,20.9
  Bottom 0.406: SW4.COM1 39.12,12.57 40.13,11.56 40.13,8.76 38.48,7.11 38.48,4.95 J9.2
GND  (via drill 0.25, 0.25 pad 0.51, 0.25 pad 0.61, 0.3 pad 0.61)
  Top 0.305: D6.- v1.4,15.88 | D5.- v1.4,9.14 | D2.- v1.4,12.45
  Top 0.381: C42.2 v9.27,35.05 | Q2.2 v12.45,34.8 | R46.1 v10.79,35.05 | C43.2 10.54,43.81 | R66.1 v14.22,16.26 | R201.1 22.71,16.23 v22.71,15.24 | C2.1 24.69,24.31 24.11,23.72 v23.98,23.72 | C33.2 27.56,44.83 v28.57,43.81
  Top 0.508: C34.2 v14.1,47.12 | C35.2 v15.62,47.12 | R49.2 30,24.54 v30,25.53 30,25.55 | C37.1 v33.76,23.57 | v39.85,25.45 39.85,24.54 R50.2 | v32.61,27.56 C24.1 | U1.2 37.08,34.16 C1.1 v37.21,35.23 | U3.2 26.42,34.16 | C36.1 v26.54,35.26 | X3.2 31.75,32.71 31.75,33.17 v32.31,33.73
  Top 0.635: C23.1 v22.23,40.64 | 26.42,34.16 C36.1 | C38.1 32.51,46.35 v32.26,46.61 | C31.1 v60.07,20.19
  other vias: 24.89,54.74 22.35,54.74 17.27,54.86 14.73,54.86 12.06,54.86 29.97,54.74 35.05,54.74 40.13,54.86 42.55,54.86 45.34,54.86 47.75,54.86 50.42,54.86 5.84,4.95 5.59,31.5 5.59,34.16 4.57,37.47 1.14,37.72 1.52,40.39 1.4,44.07 1.14,48.77 1.52,54.36 5.71,55.37 4.7,48.77 6.35,45.85 9.53,45.72 4.57,43.18 27.94,39.5 34.67,39.5 18.41,48.39 10.54,45.72 5.71,27.69 5.71,21.08 13.08,47.12 5.71,22.48 5.77,20.22 20.8,21.54 20.02,21.51 13.74,22.78 13.77,22.05 13.79,21.31 20.5,28.12 20.52,27.25 20.5,26.19 20.5,25.3 21.56,31.47 21.41,29.69 21.39,33.73 21.36,32.38 14.5,22.78 14.5,22.02 14.5,21.26 7.29,18.44 7.29,17.3 6.15,17.17 4.88,14.5 3.1,18.19 0.94,17.55 0.81,13.23 0.94,6.25 11.48,10.82 11.48,9.55 7.92,9.3 7.92,10.31 7.16,10.31 7.16,9.3 9.96,0.91 23.85,19.51 23.22,18.87 24.61,25.48 29.18,25.6 53.98,48.39 55.12,48.39 56.39,48.39 58.8,45.59 58.8,44.58 61.85,47.37 64.26,45.47 64.14,51.56 58.67,55.12 64.26,40.13 64.26,33.91 43.31,19.81 34.29,8.64 43.18,8.38 43.31,13.84 42.42,2.41 34.42,0.64 22.23,0.76 13.21,0.76 6.6,0.89 1.52,1.52 22.73,11.94 20.32,6.73 29.59,2.41 34.42,13.59 14.99,3.05 31.62,22.61 11.63,21.18 10.87,21.18 0.97,3.78 30.81,43.79 39.7,46.46 42.62,41.38 48.46,36.42 51.38,33.63 51.89,37.06 58.24,35.41 50.62,43.54 51.13,45.31 47.07,45.31 59.26,50.65 22.61,13.84 27.18,18.54 25.94,14.31 26.08,16.41 34.42,18.54 37.97,19.05 38.07,16.11 37.77,12.2 41.66,6.1 35.69,6.1 30.1,5.71 16.38,4.83 16.38,0.76 26.8,12.06 32.64,20.07 29.34,19.68 7.16,8.28 7.92,8.28 11.48,8.28 59.31,14.73 56.77,28.96 57.78,28.96 63.88,23.88 64.14,19.18 64.26,13.34 64.01,6.86 57.02,1.02 51.69,1.14 44.45,1.02 50.55,6.22 50.04,13.08 47.88,17.78 58.8,18.16 59.18,12.57 64.01,31.24 48.9,32.13 51.69,32.13 50.42,32.13 47.37,23.37 47.37,22.48 49.28,23.37 49.28,26.16 47.12,26.16 42.24,47.98 54.94,46.2 50.55,19.81 51.69,18.92 56.64,20.07 56.64,18.54 57.86,23.57 54.18,29.9 55.37,26.8
  pour Bottom (rank 6): -0.64,57.53 -0.64,-0.76 66.17,-0.76 66.17,57.53
  pour Top (rank 6): -0.89,57.78 -0.89,-0.64 66.42,-0.64 66.42,57.78
GPIO_24_RPI
  Top 0.152: R38.2 19.68,47.51 20.82,48.64 21.97,48.64 22.35,49.02 22.35,51.91 22.89,52.45 26.82,52.45 27.56,53.19 27.56,54.48 27.79,54.72 U10.18
GPIO_25_RPI
  Top 0.152: U10.22 33.75,54.74 33.02,54.74 32.64,54.36 32.64,53.09 32.13,52.58 28.07,52.58 27.43,51.94 27.43,49.14 26.55,48.26 26.54,48.26 26.29,48.01 21.08,48.01 20.57,47.5 20.57,43.69 19.81,42.93 R29.2
N$1
  Top 0.305: R47.1 6.82,42.8 5.97,43.65 5.97,44.58 5.59,44.96 SW1.1
N$2
  pour Top (no thermals): 20.7,14.86 19.43,14.86 19.05,14.48 19.05,8.26 19.43,7.87 21.08,7.87 21.46,8.26 21.46,14.35 20.95,14.86
N$3
  Top 0.305: R55.1 U11.6
N$4
  Top 0.152: R64.1 18.44,16.26 C114.2 R115.1
  Top 0.381: R115.1 18.44,16.26 | C114.2 R64.1
N$5
  Top 0.305: X1.3 41.16,32.89 41.15,32.91 R55.2
N$6
  Top 0.152: 27.78,26.67 U3.8
  Top 0.508: U3.8 27.69,26.04 28.45,25.27 R49.1
N$7
  Top 0.152: 11.94,19.43 12,19.37 | 22.63,17.78 R201.2
  Top 0.381: U14.5 11.94,19.43 | 12,19.37 12.57,18.8 18.26,18.8 18.85,19.38 20.65,19.38 21.21,18.82 R7.1 22.63,17.78
N$8
  Top 0.305: R8.2 42.67,30.66 X1.1
N$9
  Top 0.381: 30.11,27.67 C24.2
  Top 0.508: X3.4 30.23,30.79 R54.1 C24.2 30.23,26.75 30.45,26.52 30.63,26.34 32.61,26.34 33.35,27.08 33.35,28.09 33.96,28.7 34.67,28.7 35.81,28.7 R8.1 | R8.1 C3.2 41.2,27.13 41.2,26.11 L3.1 | R8.1 41.15,30.66 X1.4
N$10
  Top 0.406: SW4.CH2A 41.94,15.04 R39.1
N$11
  Top 0.305: X3.3 30.24,33.08 31.24,34.09 R56.2
N$12
  Top 0.406: SW4.CH1A 39.4,15.09 R39.2
N$13
  Top 0.152: R29.1 19.81,40.04 20.48,39.37 26.46,39.37 27.18,38.65 U4.4
N$14  (via drill 0.3 pad 0.61)
  Top 0.152: R38.1 19.68,43.81 18.92,43.05 18.92,39.81 20.12,38.61 v26.16,38.61 | v37.08,38.61 U11.4
  Bottom 0.152: v26.16,38.61 v37.08,38.61
N$15
  Top 0.381: 38.45,26.67 U1.8
  Top 0.508: U1.8 R50.1
N$16
  Top 0.152: R37.1 U11.13
N$17
  Top 0.406: R3.1 31.19,18.24 31.19,15.11 SW3.CH2A
N$18
  Top 0.152: U4.13 24.64,42.69 23.9,43.43 22.69,43.43 21.34,44.78 R28.1
N$19
  Top 0.152: R25.1 22.61,44.45 23.11,43.94 24.13,43.94 24.64,43.43 25.17,43.43 25.91,42.69 U4.12
N$20
  Top 0.152: R26.1 24.77,43.94 25.4,43.94 25.91,43.43 26.54,43.43 27.18,42.8 U4.11
N$21
  Top 0.152: 25.15,44.7 R27.1 26.04,43.94 27.18,43.94 28.45,42.67 U4.10
N$22
  Top 0.406: R3.2 28.7,15.06 SW3.CH1A
N$23
  Top 0.305: R22.1 D5.+
N$24
  Top 0.254: 51.15,25.81 50.92,25.58 U15.8
  Top 0.635: U5.3 52.85,25.13 C6.1 52.83,27.69 51.94,27.69 51.15,26.89 51.15,25.81
N$25
  Top 0.152: U2.7 58.59,22.65 58.67,22.73 58.4,23 U2.8 58.52,23 58.67,22.85
  Top 0.635: R1.1 59.83,22.85 58.67,22.85
N$26
  Top 0.152: R34.1 U11.12
N$27  (via drill 0.3)
  Top 0.406: BAT1.+ 53.27,19.25 v52.07,20.45
  Top 0.635: U5.2 54.51,25.91 v53.72,25.91
  Bottom 0.406: v53.72,25.91 53.72,24 52.07,22.35 v52.07,20.45
N$28
  Top 0.152: X2.1 44.24,22.65 45,23.41 C4.2 46.74,24.11 46.74,24.89 46.92,25.08 U15.2
N$29
  Top 0.152: U15.1 46.6,25.58 C5.2 45.09,24.98 44.37,25.7 X2.2
N$30
  Top 0.152: R35.1 U11.11
N$31
  Top 0.152: R36.1 U11.10
N$32  (via drill 0.25)
  Top 0.152: U9.5 43.34,29.97
  Top 0.254: 43.34,29.97 v43.31,29.97
  Bottom 0.152: v43.31,29.97 43.31,25.02 42.8,24.51 TP1.T
N$33
  Top 0.305: R56.1 U4.6
N$38
  Top 0.305: D2.+ R21.1
N$40
  Top 0.305: R51.1 D6.+
N$42  (via drill 0.25 pad 0.51)
  Top 0.381: C113.2 v17.65,19.81
  Bottom 0.381: v17.65,19.81 16,19.81 13.72,19.81 12.41,21.12 12.41,23 11.94,23.47 v11.94,23.5
  pour Top (no thermals): 11.73,22.1 11.73,22.89 11,23.62 8.38,23.62 7.75,24.26 7.75,26.42 8.26,26.92 14.1,26.92 14.61,26.42 14.61,24.13 14.1,23.62 12.85,23.62 12.14,22.91 12.14,22.1
N$46
  Top 0.635: R30.1 58.27,24.51 U8.5
N$49
  Top 0.305: Q1.4 14.69,38.48 | 14.69,38.48 14.69,36.92 Q2.3 | R32.2 7.75,38.73 8,38.48 14.35,38.48 | 14.35,38.48 14.69,38.48 | 14.35,38.48 14.35,38.61 14.61,38.86 | 14.35,38.48 14.61,38.23
N$51  (via drill 0.35)
  Top 0.381: SW1.2 5.89,41.91 6.35,41.45 6.35,36.45 v6.86,35.94 R48.1 | R51.2 v4.83,15.88
  Bottom 0.381: v4.83,15.88 4.83,17.53 6.6,19.3 6.6,35.69 v6.86,35.94
N$52
  Top 0.381: Q2.1 12.32,37.47 R46.2 C42.1 R48.2
N$53
  Top 0.762: L1.2 58.98,30.35 F2.1
  Top 0.889: F2.1 59.11,30.4
N$54
  Top 0.508: X3.1 31.74,29.09 R54.2
N$86
  Top 0.381: U14.6 13.14,19.81 C113.1
N$120
  Top 0.152: 15.24,17.78 R66.2
  Top 0.381: C114.1 R115.2 15.24,17.78 | R66.2 12.57,17.78 10.99,19.36 U14.4
N$199
  Top 0.381: R7.2 21.21,16 20.57,15.37 17.4,15.37
  Top 0.406: F6.2 16.43,14.4 17.4,15.37
  pour Top (no thermals): 16,15.24 13.84,15.24 10.03,19.05 10.03,21.34 10.57,21.87 10.82,21.87 11.18,22.23 11.18,22.86 10.92,23.11 8.76,23.11 8.38,22.73 8.38,15.11 9.78,13.72 10.92,13.72 12.95,11.68 16.75,11.68 16.86,14.39
RX_A
  Top 0.381: U4.1 23.37,35.81 22.99,35.43 22.99,31.34 23.55,30.79 27.08,30.79 27.69,31.39 U3.1
RX_B
  Top 0.381: U11.1 33.27,31.06 33.78,30.56 37.97,30.56 38.35,30.94 U1.1
SCL_H  (via drill 0.25)
  Top 0.152: R2.1 51.05,20.95 52.2,22.1 55.37,22.1 56.64,20.83 58.67,20.83 59.05,21.21 v59.05,22.1 58.85,22.3 U2.6 | J4.1 60.45,42.5 61.47,41.48 61.47,35.97 59.36,33.86 v59.36,33.45
  Top 0.203: J3.1 J4.1
  Bottom 0.152: v59.36,33.45 59.05,33.15 v59.05,22.1
SCL_RPI  (via drill 0.25, 0.3 pad 0.61)
  Top 0.152: v13.46,48.39 13.46,50.27 U10.5 | U15.6 51.37,24.58 v51.44,24.51 51.69,24.26 51.69,23.5 52.13,23.05 55.81,23.05 56.55,22.3 U2.3 | R5.1 50.1,27.75 50.16,27.69 v50.16,26.8 47.5,26.8 46.99,27.3 44.7,27.3 44.39,27.62 U9.1
  Bottom 0.152: v13.46,48.39 14.38,49.3 38.46,49.3 47.12,40.64 47.12,30.23 47.12,27.43 47.75,26.8 v50.16,26.8 51.44,25.53 v51.44,24.51
SDA_H  (via drill 0.25)
  Top 0.152: J4.2 60.2,40.5 60.71,39.99 60.71,35.89 v58.78,33.96 | R4.1 50.08,22.44 55.55,22.44 56.79,21.21 58.42,21.21 58.55,21.34 v58.55,21.59 58.55,21.84 58.44,21.95 U2.5
  Top 0.203: J4.2 J3.2
  Bottom 0.152: v58.78,33.96 58.55,33.73 v58.55,21.59
SDA_RPI  (via drill 0.25, 0.3 pad 0.61)
  Top 0.152: v12.57,48.39 12.19,48.39 10.91,49.67 U10.3 | R6.1 v47.75,27.81 46.61,27.81 46.29,28.13 U9.3 | U2.4 56.47,21.95 55.68,22.75 51.79,22.75 v51.2,23.34 51.18,23.36 51.18,23.88 50.97,24.08 U15.5
  Bottom 0.152: v12.57,48.39 14.04,49.86 38.53,49.86 47.68,40.72 47.68,27.89 v47.75,27.81 50.16,27.81 51.97,26.01 51.97,24.12 v51.2,23.34
SPI0_CE0  (via drill 0.3 pad 0.61)
  Top 0.152: R28.2 v21.34,47.37 | U10.24 36.41,54.61 37.19,54.61 37.59,54.21 37.59,49.4 36.7,48.51 v36.32,48.51
  Bottom 0.152: v36.32,48.51 35.94,48.51 34.72,47.3 30.66,47.3 29.97,46.61 22.1,46.61 v21.34,47.37
SPI0_CE1  (via drill 0.25)
  Top 0.152: R37.2 34.54,46.45 v35.06,46.97 | v38.61,47.75 40.13,49.28 40.13,54.1 39.5,54.74 38.87,54.74 U10.26
  Bottom 0.152: v35.06,46.97 35.85,47.75 v38.61,47.75
SPI0_CLK  (via drill 0.3 pad 0.61)
  Top 0.152: v25.15,47.37 R27.2 | U10.23 36.31,49.77 v35.05,48.51 35.94,47.62 37.08,47.62 R36.2
  Bottom 0.152: v25.15,47.37 25.4,47.12 29.59,47.12 30.35,47.88 34.42,47.88 v35.05,48.51
SPI0_MISO  (via drill 0.3 pad 0.61)
  Top 0.152: v22.61,47.37 R25.2 | U10.21 33.77,48.53 v33.78,48.51 34.16,48.51 35.81,46.86 R34.2
  Bottom 0.152: v33.78,48.51 23.75,48.51 v22.61,47.37
SPI0_MOSI  (via drill 0.25, 0.3 pad 0.61)
  Top 0.152: 31.24,50.29 U10.19 31.23,49.77 v29.21,47.75 v29.21,45.97 | v23.88,47.37 R26.2 | R35.2 36.58,46.86 v36.58,47.17
  Bottom 0.152: v29.21,47.75 28.96,48.01 24.51,48.01 v23.88,47.37 | v36.58,47.17 35.26,45.85 29.34,45.85 v29.21,45.97
TX_A
  Top 0.381: U4.2 24.64,35.69 23.9,34.95 23.9,32.19 U3.4
TX_B
  Top 0.381: U11.2 U1.4
VCC5V2  (via drill 0.25 pad 0.51)
  Top 0.127: C133.2 C134.2
  Top 0.381: R64.2 v19.68,18.67 | R21.2 v4.83,12.45
  Bottom 0.381: VCC5VSENSOR.T 17.4,22.76 19.68,20.47 v19.68,18.67 16.26,15.24 7.62,15.24 v4.83,12.45
  other vias: 16,24.64 16,25.27
  pour Top (no thermals): 7.73,31.25 7.73,33.24 8.33,33.83 15.49,33.78 15.88,34.16 15.88,35.43 16.51,36.07 21.21,36.07 21.34,35.94 21.34,35.05 21.08,34.8 18.41,34.8 18.03,34.42 18.03,22.53 17.7,22.2 15.57,22.2 15.29,22.48 15.29,24.13 15.54,24.38 15.54,29.95 14.76,30.73 8.26,30.73
  pour Bottom (no thermals): 15.88,25.65 17.78,25.65 18.03,25.4 18.03,23.37 17.65,22.99 17.02,22.99 15.62,24.38 15.62,25.4
VCC_3V3  (via drill 0.25, 0.25 pad 0.51, 0.3 pad 0.61)
  Top 0.203: U2.2 56.77,22.65 56.48,22.95
  Top 0.305: 56.48,22.95 56.39,23.04 56.39,23.5
  Top 0.381: C38.2 33.27,44.7 | 33.27,42.42 U11.14 | 23.78,26.67 U3.5 | v23.14,23.72 23.14,22.45 22.86,22.17 v22.86,19.68 | R22.2 v4.83,9.14
  Top 0.508: U3.5 23.88,25.96 23.16,25.25 C2.2 23.14,24.49 v23.14,23.72 23.14,24.05 | U1.5 34.47,26.69 34.47,25.91 33.22,24.66 C37.2 33.22,24.54 32.99,24.31 v32.99,23.55
  Top 0.61: 32.13,41.2 32.81,40.51 33.27,40.51
  Top 0.635: C23.2 21.24,42.2 U4.14 23.37,41.33 24.18,40.51 31.45,40.51 | 31.45,40.51 32.13,41.2 32.13,44.2 32.77,44.83 C38.2 | 33.27,44.7 33.27,42.42 | 31.45,40.51 33.27,40.51 41.02,40.51 42.04,39.5 42.04,35.05 v44.58,32.51 45.85,32.51 46.29,32.07 U9.4 46.32,30.99 C29.2 R6.2 R5.2 51.69,29.34 C30.1 52.48,28.8 55.78,28.8 56.39,28.19 C27.2 C26.2 R30.2 56.39,24.13 | v41.91,22.48 L3.2 | 56.39,23.5 56.39,24.13 | U5.1 54.77,24.13 56.39,24.13
  Bottom 0.381: v22.86,19.68 17.14,13.97 9.65,13.97 v4.83,9.14 | 32.99,24.16 33.48,24.64 33.53,24.64
  Bottom 0.635: v23.14,23.72 23.14,24.28 23.5,24.64 32.51,24.64 | 32.51,24.64 33.53,24.64 38.48,24.64 40.64,22.48 v41.91,22.48 43.31,22.48 44.58,23.75 v44.58,32.51 | 32.51,24.64 32.99,24.16 v32.99,23.55
VCC_5V  (via drill 0.25, 0.25 pad 0.51, 0.3 pad 0.61)
  Top 0.381: Q1.3 14.04,39.57 13.97,39.5 | Q1.2 13.39,39.57 13.46,39.5 | 12.7,39.5 12.74,39.54 Q1.1 12.64,40.26 | 10.92,40.26 12.64,40.26 | 12.64,40.26 12.64,39.94 12.57,39.88 11.3,39.88 11.05,40.13
  Top 0.508: U1.3 35.81,34.16 C1.2 | U3.3 25.15,34.16 | C36.2 25.02,34.82 v25.43,35.23
  Top 0.635: 25.15,34.16 C36.2 | 63.25,27.56 63.25,26.29 62.93,25.97 U8.1 61.59,25.64 C28.2 R1.2 C31.2 61.59,18.92 59.05,16.38 56.59,16.38 51.94,16.38 v48.51,19.81 R2.2 R4.2 | 63.25,27.56 63.25,28.19 | F2.2 62.31,29.52 63.25,28.57 63.25,28.19 | U8.3 62.93,27.87 | 62.93,27.87 63.25,27.56 | 62.93,27.87 63.25,28.19
  Top 0.889: F2.2 62.43,30.61 | v17.02,38.23 D9.- | C1.2 v35.69,35.2
  Bottom 0.889: v17.02,38.23 18.54,36.7 25.4,36.7 | v25.43,35.23 25.43,36.68 25.4,36.7 | 25.4,36.7 34.19,36.7 v35.69,35.2 37.11,33.78 44.96,33.78 45.85,32.89 45.85,22.48 v48.51,19.81
  other vias: 11.94,39.62 11.3,39.62 10.67,39.62 10.67,40.26 11.3,40.26 11.94,40.26 16.38,38.23 15.75,38.99 15.75,38.35 15.75,37.72
  pour Top (no thermals): 14.22,39.5 13.9,39.17 9.3,39.17 8.78,39.69 8.78,41.44 8.87,41.53 11.11,41.53 11.32,41.32 11.3,39.88 11.43,39.75 14.22,39.75
  pour Bottom (no thermals): 10.54,40.64 17.27,40.64 17.78,40.13 17.78,37.47 17.4,37.08 10.54,37.08 10.16,37.47 10.16,40.26
  pour Top (no thermals): 17.27,40.13 16.38,40.13 15.49,39.24 15.49,37.34 15.88,36.96 19.56,36.96 19.56,37.72 18.8,38.48 17.78,38.48 17.53,38.73 17.53,39.88
VCC_5V_PI
  Top 0.305: 12.74,43.58 15.51,43.58 15.62,43.69
  Top 0.381: Q1.8 12.74,43.58 12.74,43.98 13.21,44.45 | Q1.7 13.39,44.38 13.46,44.45 | Q1.6 14.04,43.89 14.1,43.94 C34.1 | 14.69,43.38 Q1.5 16.03,43.16 16.13,43.05 | 14.69,43.38 14.69,43.9 14.73,43.94 14.73,44.32 14.86,44.45 | 15.71,44.23 15.46,44.23 15.37,44.32 | 14.69,43.38 15.55,43.38 15.62,43.31
  Top 0.508: 10.41,54.74 10.89,54.74 U10.4 | 15.24,44.45 C35.1 | C34.1 14.1,44.45
  Top 1.27: D9.+ 16.89,43.05 15.71,44.23 | 15.37,44.32 15.24,44.45
  Top 1.524: 10.41,54.74 10.39,54.72 U10.2 8.35,54.74 7.3,54.74 6.51,53.95 6.51,48.53 7.42,47.62 10.52,47.62 11.97,46.17 D4.2 13.21,44.45 13.46,44.45 14.1,44.45 14.86,44.45 15.24,44.45
VCC_EXT
  pour Top (no thermals): 17.02,10.54 14.99,10.54 10.54,6.1 10.54,2.92 11.18,2.29 12.45,2.29 17.02,6.86
VCC_G
  Top 0.762: C19.2 53.44,31.45 C22.2 C20.2 55.65,32.13 L1.1
  Top 0.889: J3.3 53.59,38.5 | 53.59,38.5 J4.3 | 53.49,37.69 C21.2 53.44,34.54 C19.2 | 53.59,37.72 53.59,37.59 53.49,37.69 | 53.59,37.72 53.59,38.5 | 53.49,37.69 52.7,38.48 | 53.59,37.72 54.36,38.48

### Text on the board
tPlace: Power to RPI | ON | SCL | SCL | SDA | SDA | 5V | 5V | OFF | GND | GND | ON | ON | RPI | 120R | 120R | 5V | OFF | OFF | GND | 0_L | 0_H | GND | 1_L | 1_H | 3V3 | CR1220
bPlace: CAN-BUS(FD) HAT for Raspberry Pi | www.seeedstudio.com | v1.0 6/28/2020 | CAN_0_L | CAN_0_H | CAN_1_L | CAN_1_H | GND | GND | GND | VIN | DC 12 - 24V